# EAGLE design input_pull_up (EAGLE 7.1.0)
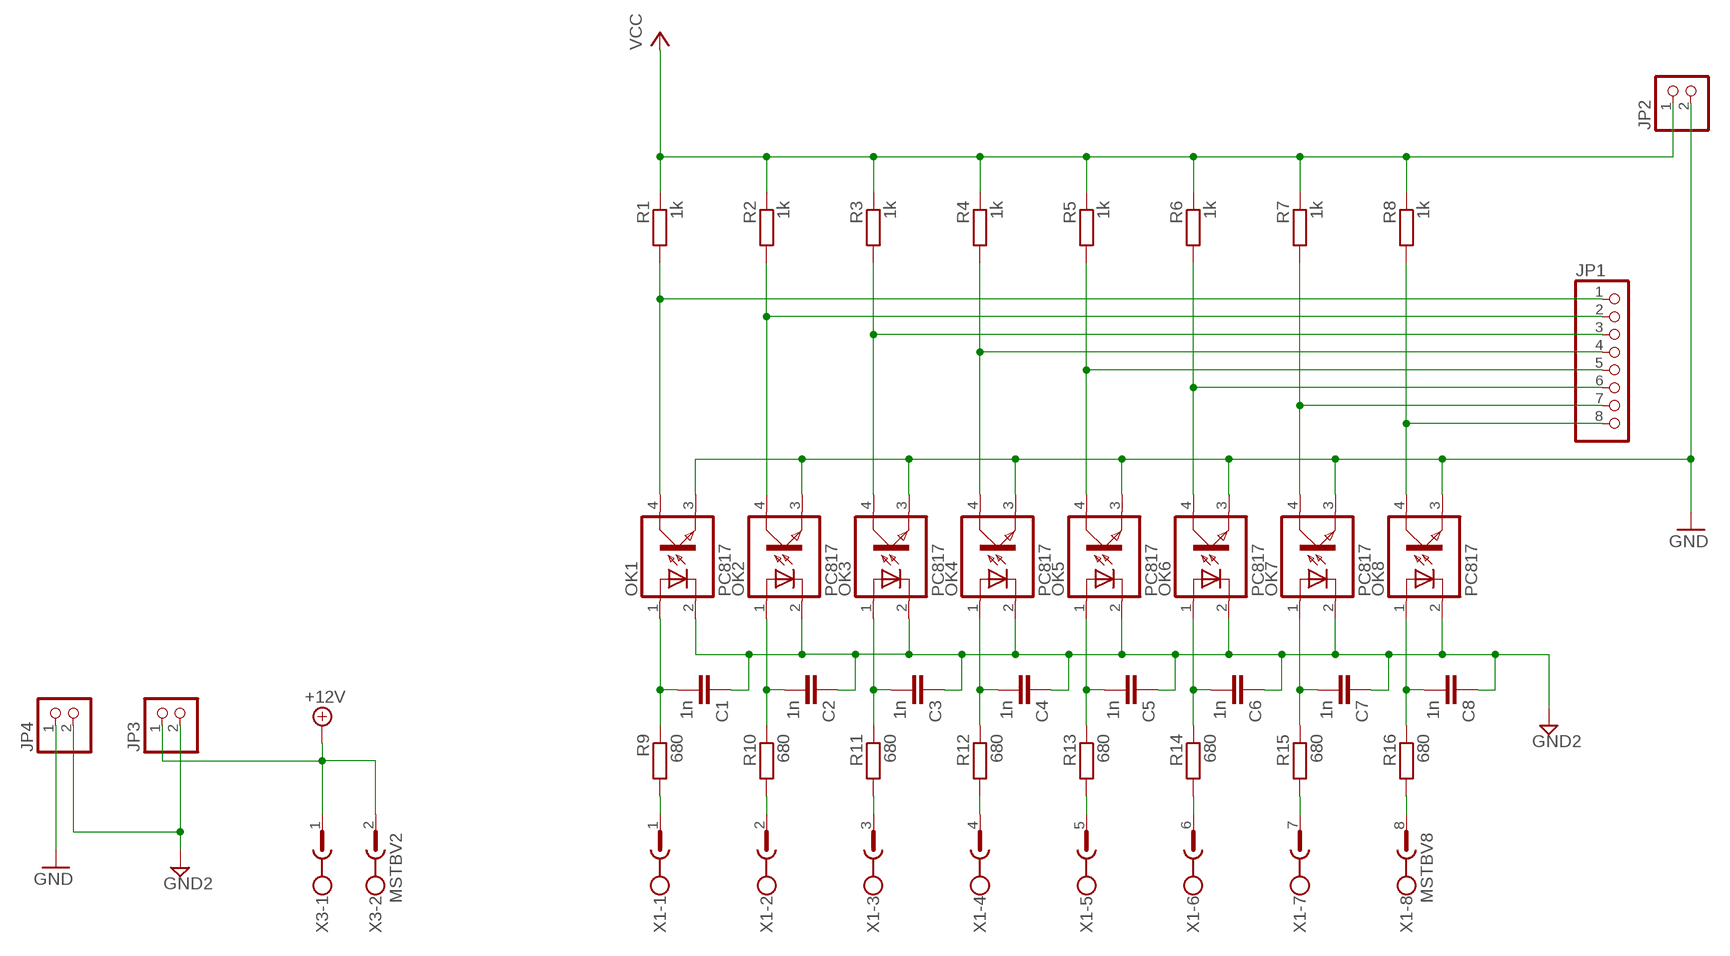
[diagram p0: schematic, sheet 1]

## Parts
C1  1n  C-EU050-025X075  [C050-025X075]
C2  1n  C-EU050-025X075  [C050-025X075]
C3  1n  C-EU050-025X075  [C050-025X075]
C4  1n  C-EU050-025X075  [C050-025X075]
C5  1n  C-EU050-025X075  [C050-025X075]
C6  1n  C-EU050-025X075  [C050-025X075]
C7  1n  C-EU050-025X075  [C050-025X075]
C8  1n  C-EU050-025X075  [C050-025X075]
JP1  PINHD-1X8  [1X08]
JP2  PINHD-1X2  [1X02]
JP3  PINHD-1X2  [1X02]
JP4  PINHD-1X2  [1X02]
OK1  PC817  [DIL04]
OK2  PC817  [DIL04]
OK3  PC817  [DIL04]
OK4  PC817  [DIL04]
OK5  PC817  [DIL04]
OK6  PC817  [DIL04]
OK7  PC817  [DIL04]
OK8  PC817  [DIL04]
R1  1k  R-EU_0204/7  [0204/7]
R2  1k  R-EU_0204/7  [0204/7]
R3  1k  R-EU_0204/7  [0204/7]
R4  1k  R-EU_0204/7  [0204/7]
R5  1k  R-EU_0204/7  [0204/7]
R6  1k  R-EU_0204/7  [0204/7]
R7  1k  R-EU_0204/7  [0204/7]
R8  1k  R-EU_0204/7  [0204/7]
R9  680  R-EU_0204/7  [0204/7]
R10  680  R-EU_0204/7  [0204/7]
R11  680  R-EU_0204/7  [0204/7]
R12  680  R-EU_0204/7  [0204/7]
R13  680  R-EU_0204/7  [0204/7]
R14  680  R-EU_0204/7  [0204/7]
R15  680  R-EU_0204/7  [0204/7]
R16  680  R-EU_0204/7  [0204/7]
X1  MSTBV8  [MSTBV8]
X3  MSTBV2  [MSTBV2]

## Nets
+12V: JP3.1 X3.1 X3.2
GND: JP2.2 JP4.1 OK1.3(EMIT) OK2.3(EMIT) OK3.3(EMIT) OK4.3(EMIT) OK5.3(EMIT) OK6.3(EMIT) OK7.3(EMIT) OK8.3(EMIT)
GND2: C1.1 C2.1 C3.1 C4.1 C5.1 C6.1 C7.1 C8.1 JP3.2 JP4.2 OK1.2(C) OK2.2(C) OK3.2(C) OK4.2(C) OK5.2(C) OK6.2(C) OK7.2(C) OK8.2(C)
N$1: JP1.1 OK1.4(COL) R1.2
N$2: JP1.2 OK2.4(COL) R2.2
N$3: JP1.3 OK3.4(COL) R3.2
N$4: JP1.4 OK4.4(COL) R4.2
N$5: JP1.5 OK5.4(COL) R5.2
N$6: JP1.6 OK6.4(COL) R6.2
N$7: JP1.7 OK7.4(COL) R7.2
N$8: JP1.8 OK8.4(COL) R8.2
N$13: R9.2 X1.1
N$14: R10.2 X1.2
N$15: R11.2 X1.3
N$16: R12.2 X1.4
N$17: R13.2 X1.5
N$18: R14.2 X1.6
N$19: R15.2 X1.7
N$20: R16.2 X1.8
N$21: C1.2 OK1.1(A) R9.1
N$22: C2.2 OK2.1(A) R10.1
N$23: C3.2 OK3.1(A) R11.1
N$24: C4.2 OK4.1(A) R12.1
N$25: C5.2 OK5.1(A) R13.1
N$26: C6.2 OK6.1(A) R14.1
N$27: C7.2 OK7.1(A) R15.1
N$28: C8.2 OK8.1(A) R16.1
VCC: JP2.1 R1.1 R2.1 R3.1 R4.1 R5.1 R6.1 R7.1 R8.1

## Library data of the parts
C1-C8 = rcl:C-EU: CAPACITOR, European symbol
JP1 = pinhead:PINHD-1X8: PIN HEADER
JP2-JP4 = pinhead:PINHD-1X2: PIN HEADER
OK1-OK8 = optocoupler:PC817: SHARP OPTO COUPLER; MPN: PC817X4J000F; OC_FARNELL: 9707727; OC_NEWARK: 97K7059
R1-R16 = rcl:R-EU_: RESISTOR, European symbol
X1 = con-phoenix-508:MSTBV8: PHOENIX
X3 = con-phoenix-508:MSTBV2: PHOENIX

## Board
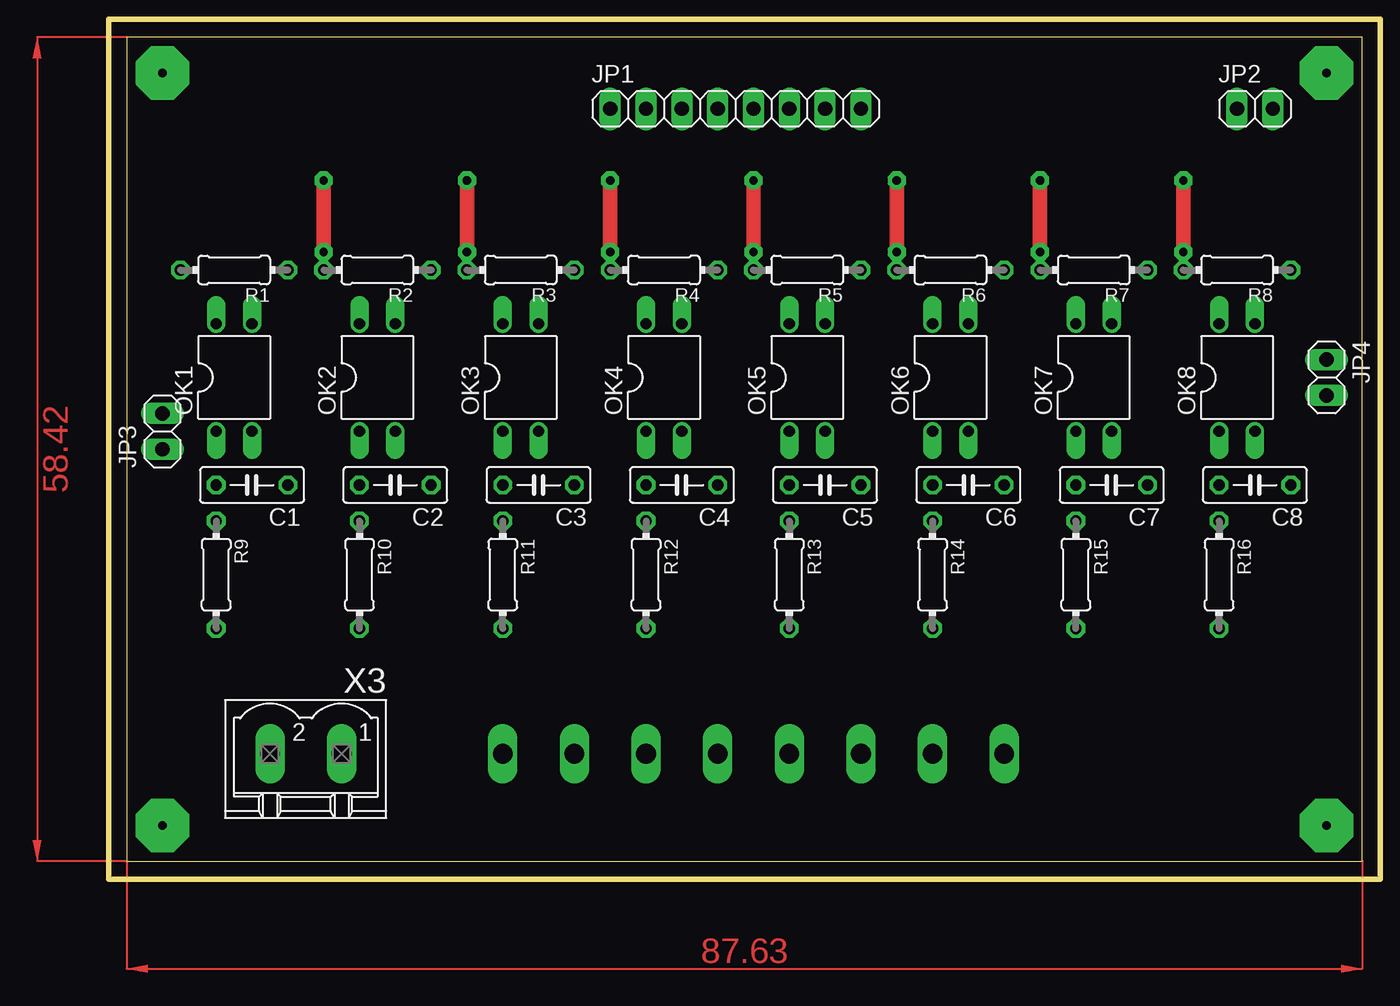
[diagram p1: board, top side]
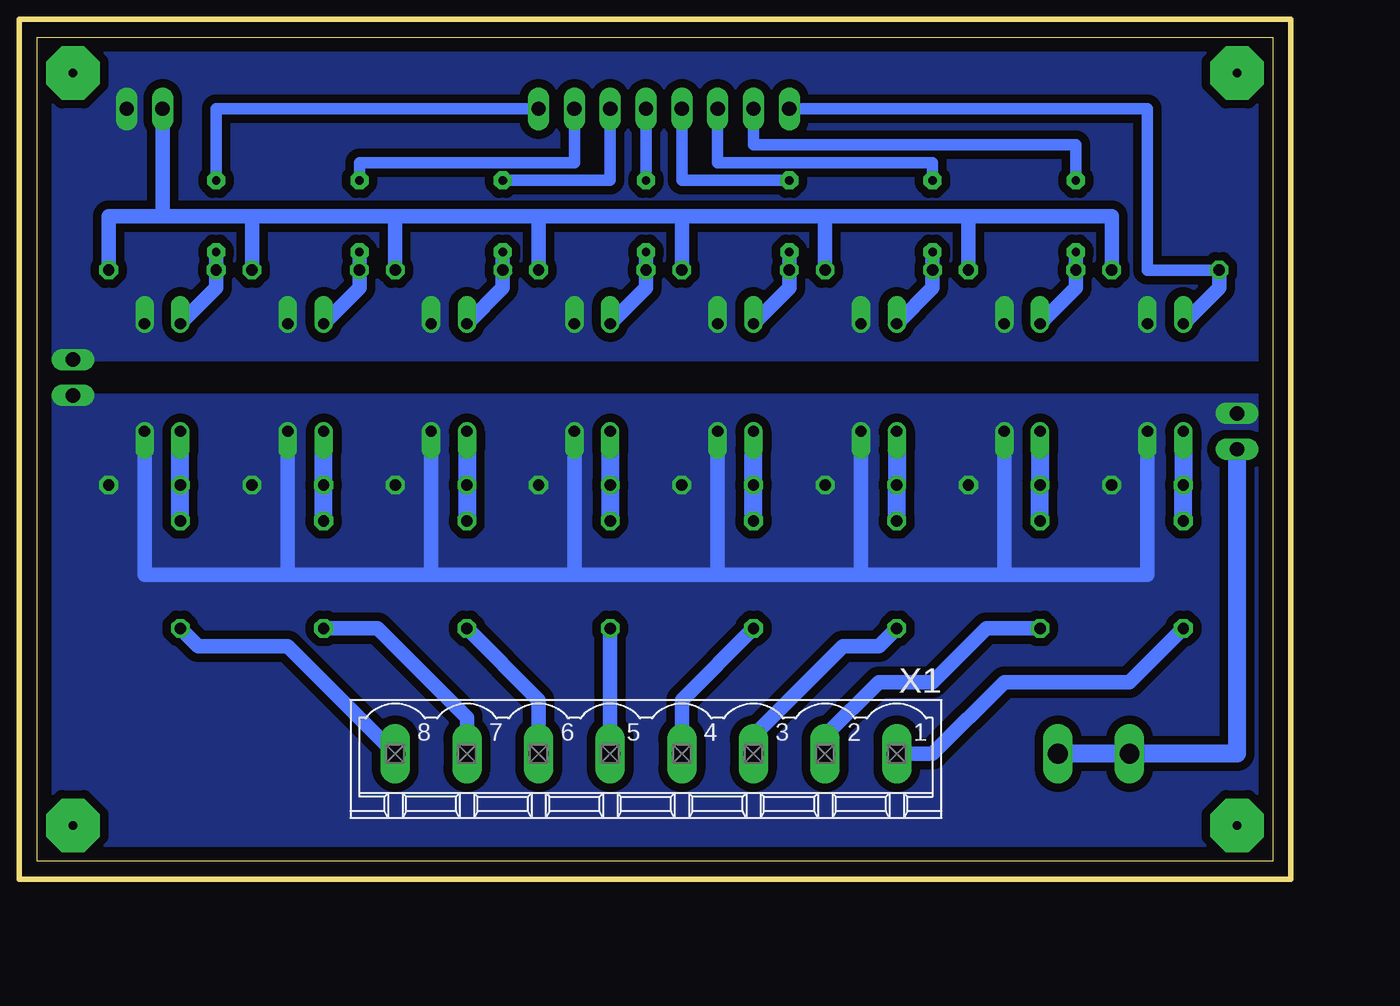
[diagram p2: board, bottom side, seen from below]

Size 87.61 x 58.42 mm. Coordinates in mm from the lower left corner, seen from the top.
Outline: 0,0 87.61,0 87.61,58.42 0,58.42 0,0
Copper layers (1*16): Top 0.035mm / dielectric 1.5mm / Bottom 0.035mm
Design rules "default": minimum track width 10mil, minimum drill 24mil, track to track 8mil, track to pad 8mil, pad to pad 8mil, via to via 8mil, smd to smd 8mil, copper to edge 40mil, drill to drill 8mil, minimum pad ring 10mil, minimum via ring 8mil, stop-mask expansion 4mil, vias tented up to drill 0mil, thermal gap 10mil
Milling: 4 lines

### Footprints (pad centres in the part's own frame; a part is rotated, then mirrored left to right if it is on the bottom)
C050-025X075 = drill 0.813 octagon: 1 -2.54,0; 2 2.54,0
1X08 = drill 1.016 long: 1 -8.89,0; 2 -6.35,0; 3 -3.81,0; 4 -1.27,0; 5 1.27,0; 6 3.81,0; 7 6.35,0; 8 8.89,0
1X02 = drill 1.016 long: 1 -1.27,0; 2 1.27,0
DIL04 = drill 0.813 offset: 1 -1.27,-3.81; 2 1.27,-3.81; 3 1.27,3.81; 4 -1.27,3.81
0204/7 = drill 0.813 octagon: 1 -3.81,0; 2 3.81,0
MSTBV8 = drill 1.397 long: 1 -17.78,0; 2 -12.7,0; 3 -7.62,0; 4 -2.54,0; 5 2.54,0; 6 7.62,0; 7 12.7,0; 8 17.78,0
MSTBV2 = drill 1.397 long: 1 -2.54,0; 2 2.54,0

### Placement (x,y rotation side)
C1  8.89,26.67 180 top
C2  19.05,26.67 180 top
C3  29.21,26.67 180 top
C4  39.37,26.67 180 top
C5  49.53,26.67 180 top
C6  59.69,26.67 180 top
C7  69.85,26.67 180 top
C8  80.01,26.67 180 top
JP1  43.18,53.34 0 top
JP2  80.01,53.34 0 top
JP3  2.54,30.48 90 top
JP4  85.09,34.29 270 top
OK1  7.62,34.29 0 top
OK2  17.78,34.29 0 top
OK3  27.94,34.29 0 top
OK4  38.1,34.29 0 top
OK5  48.26,34.29 0 top
OK6  58.42,34.29 0 top
OK7  68.58,34.29 0 top
OK8  78.74,34.29 0 top
R1  7.62,41.91 180 top
R2  17.78,41.91 180 top
R3  27.94,41.91 180 top
R4  38.1,41.91 180 top
R5  48.26,41.91 180 top
R6  58.42,41.91 180 top
R7  68.58,41.91 180 top
R8  78.74,41.91 180 top
R9  6.35,20.32 270 top
R10  16.51,20.32 270 top
R11  26.67,20.32 270 top
R12  36.83,20.32 270 top
R13  46.99,20.32 270 top
R14  57.15,20.32 270 top
R15  67.31,20.32 270 top
R16  77.47,20.32 270 top
X1  44.45,7.62 180 bottom
X3  12.7,7.62 180 top

### Tracks (layer width: path | path; a pad name or v marks a point on that pad's centre or on a via)
+12V
  Bottom 1.27: JP3.1 2.54,7.62 X3.2 X3.1
GND
  pour Bottom (isolate 0.61, no thermals): 0,35.56 87.63,35.56 87.63,58.42 0,58.42
GND2
  Bottom 1.016: OK1.2 8.89,20.32 19.05,20.32 | 19.05,20.32 OK2.2 | OK3.2 29.21,20.32 | 29.21,20.32 19.05,20.32 | OK4.2 39.37,20.32 | 39.37,20.32 29.21,20.32 | OK5.2 49.53,20.32 | 49.53,20.32 39.37,20.32 | OK6.2 59.69,20.32 | 59.69,20.32 49.53,20.32 | OK7.2 69.85,20.32 | 69.85,20.32 59.69,20.32 | OK8.2 80.01,20.32 69.85,20.32
  pour Bottom (isolate 0.61, no thermals): 0,0 87.63,0 87.63,33.02 0,33.02
N$1
  Bottom 0.813: JP1.1 8.89,53.34 8.89,41.91 R1.2
  Bottom 1.016: OK1.4 3.81,40.64 R1.2
N$2  (via drill 0.6 pad 1.27)
  Top 1.016: v13.97,48.26 v13.97,43.18
  Bottom 0.813: JP1.2 36.83,50.8 13.97,50.8 v13.97,48.26
  Bottom 1.016: OK2.4 13.97,40.64 R2.2 v13.97,43.18
N$3  (via drill 0.6 pad 1.27)
  Top 1.016: v24.13,43.18 v24.13,48.26
  Bottom 0.813: JP1.3 39.37,49.53 24.13,49.53 v24.13,48.26
  Bottom 1.016: OK3.4 24.13,40.64 R3.2 v24.13,43.18
N$4  (via drill 0.6 pad 1.27)
  Top 1.016: v34.29,43.18 v34.29,48.26
  Bottom 0.813: v34.29,48.26 41.91,48.26 JP1.4
  Bottom 1.016: OK4.4 34.29,40.64 R4.2 v34.29,43.18
N$5  (via drill 0.6 pad 1.27)
  Top 1.016: v44.45,43.18 v44.45,48.26
  Bottom 0.813: v44.45,48.26 JP1.5
  Bottom 1.016: OK5.4 44.45,40.64 R5.2 v44.45,43.18
N$6  (via drill 0.6 pad 1.27)
  Top 1.016: v54.61,43.18 v54.61,48.26
  Bottom 0.813: v54.61,48.26 46.99,48.26 JP1.6
  Bottom 1.016: OK6.4 54.61,40.64 R6.2 v54.61,43.18
  Bottom 1.27: R6.2 54.63,41.91
N$7  (via drill 0.6 pad 1.27)
  Top 1.016: v64.77,43.18 v64.77,48.26
  Bottom 0.813: v64.77,48.26 64.77,49.53 49.53,49.53 JP1.7
  Bottom 1.016: OK7.4 64.77,40.64 R7.2 v64.77,43.18
  Bottom 1.27: R7.2 64.79,41.91
N$8  (via drill 0.6 pad 1.27)
  Top 1.016: v74.93,43.18 v74.93,48.26
  Bottom 0.813: v74.93,48.26 74.93,53.34 JP1.8
  Bottom 1.016: OK8.4 74.93,40.64 R8.2 v74.93,43.18
  Bottom 1.27: R8.2 74.95,41.91
N$9  (via drill 0.6 pad 3.81)
  other vias: 2.54,2.54
N$10  (via drill 0.6 pad 3.81)
  other vias: 85.09,2.54
N$11  (via drill 0.6 pad 3.81)
  other vias: 2.54,55.88
N$12  (via drill 0.6 pad 3.81)
  other vias: 85.09,55.88
N$13
  Bottom 1.016: X1.1 24.13,7.62 19.05,12.7 10.16,12.7 R9.2
N$14
  Bottom 1.016: X1.2 31.75,8.89 27.94,12.7 24.13,12.7 20.32,16.51 R10.2
N$15
  Bottom 1.016: X1.3 36.83,8.89 30.48,15.24 27.94,15.24 R11.2
N$16
  Bottom 1.016: X1.4 41.91,11.43 R12.2
N$17
  Bottom 1.016: X1.5 R13.2
N$18
  Bottom 1.016: X1.6 52.07,11.43 R14.2
N$19
  Bottom 1.016: X1.7 57.15,10.16 63.5,16.51 R15.2
N$20
  Bottom 1.016: X1.8 69.85,15.24 76.2,15.24 R16.2
N$21
  Bottom 1.27: OK1.1 C1.2 R9.1
N$22
  Bottom 1.27: OK2.1 C2.2 R10.1
N$23
  Bottom 1.27: OK3.1 C3.2 R11.1
N$24
  Bottom 1.27: R12.1 C4.2 OK4.1
N$25
  Bottom 1.27: OK5.1 C5.2 R13.1
N$26
  Bottom 1.27: OK6.1 C6.2 R14.1
N$27
  Bottom 1.27: R15.1 C7.2 OK7.1
N$28
  Bottom 1.27: R16.1 C8.2 OK8.1
VCC
  Bottom 1.016: R1.1 11.43,45.72 21.59,45.72 | 21.59,45.72 R2.1 | R3.1 31.75,45.72 | 31.75,45.72 21.59,45.72 | R4.1 41.91,45.72 | 41.91,45.72 31.75,45.72 | R5.1 52.07,45.72 | 52.07,45.72 41.91,45.72 | R6.1 62.23,45.72 | 62.23,45.72 52.07,45.72 | R7.1 72.39,45.72 | 72.39,45.72 62.23,45.72 | R8.1 82.55,45.72 78.74,45.72 | 78.74,45.72 72.39,45.72 | JP2.1 78.74,45.72
(copper drawn outside any net)
  shapes: Top area x2